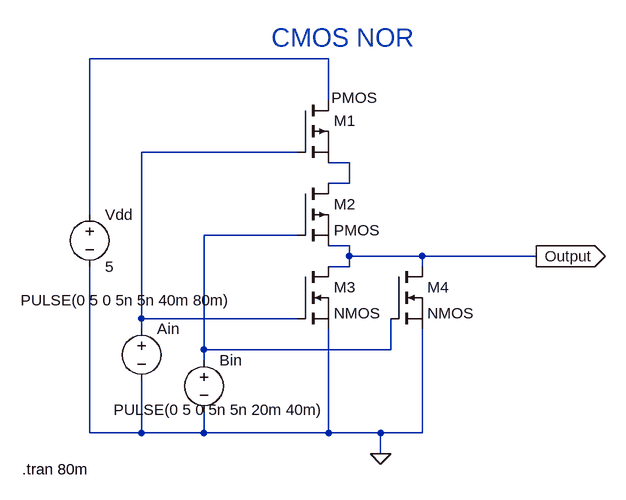
[diagram p0: schematic CMOS NOR.asc]
CMOS NOR.asc, the LTspice schematic file:
Version 4
SHEET 1 880 680
WIRE 256 -32 -112 -32
WIRE 256 32 256 -32
WIRE 208 112 -32 112
WIRE 288 128 256 128
WIRE 288 160 288 128
WIRE 288 160 256 160
WIRE -112 208 -112 -32
WIRE 208 240 64 240
WIRE 288 256 256 256
WIRE 288 272 288 256
WIRE 400 272 288 272
WIRE 576 272 400 272
WIRE 288 288 288 272
WIRE 288 288 256 288
WIRE 400 288 400 272
WIRE -32 368 -32 112
WIRE 208 368 -32 368
WIRE -32 384 -32 368
WIRE 64 416 64 240
WIRE 352 416 352 368
WIRE 352 416 64 416
WIRE 64 432 64 416
WIRE -112 544 -112 288
WIRE -32 544 -32 464
WIRE -32 544 -112 544
WIRE 64 544 64 512
WIRE 64 544 -32 544
WIRE 256 544 256 384
WIRE 256 544 64 544
WIRE 336 544 256 544
WIRE 400 544 400 384
WIRE 400 544 336 544
WIRE 336 576 336 544
FLAG 336 576 0
FLAG 576 272 Output
IOPIN 576 272 Out
SYMBOL pmos 208 32 R0
WINDOW 3 52 -4 Left 2
SYMATTR InstName M1
SYMBOL pmos 208 160 R0
SYMATTR InstName M2
SYMBOL nmos 208 288 R0
SYMATTR InstName M3
SYMBOL voltage -32 368 R0
WINDOW 3 -186 -28 Left 2
WINDOW 123 0 0 Left 0
WINDOW 39 0 0 Left 0
SYMATTR InstName Ain
SYMATTR Value PULSE(0 5 0 5n 5n 40m 80m)
SYMBOL voltage 64 416 R0
WINDOW 3 -139 92 Left 2
WINDOW 123 0 0 Left 0
WINDOW 39 0 0 Left 0
SYMATTR InstName Bin
SYMATTR Value PULSE(0 5 0 5n 5n 20m 40m)
SYMBOL voltage -112 192 R0
SYMATTR InstName Vdd
SYMATTR Value 5
SYMBOL nmos 352 288 R0
SYMATTR InstName M4
TEXT 168 -64 Left 4 ;CMOS NOR
TEXT -216 600 Left 2 !.tran 80m

The netlist it stands for:
* CMOS NOR.asc
M1 N001 N002 N003 N003 PMOS
M2 N003 N004 Output Output PMOS
M3 Output N002 0 0 NMOS
V§Ain N002 0 PULSE(0 5 0 5n 5n 40m 80m)
V§Bin N004 0 PULSE(0 5 0 5n 5n 20m 40m)
Vdd N001 0 5
M4 Output N004 0 0 NMOS
.model NMOS NMOS
.model PMOS PMOS
.lib standard.mos
* CMOS NOR
.tran 80m
.backanno
.end